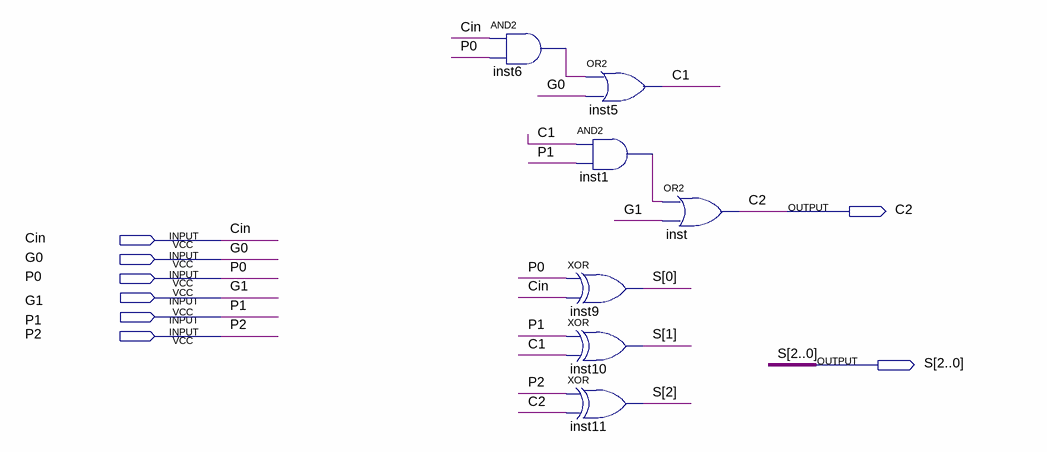
[diagram p0: schematic sheet]
// Quartus schematic COut3.bdf as structural Verilog: 7 symbols, 8 pins
module COut3 (
  input  Cin,
  input  G0,
  input  P0,
  input  G1,
  input  P1,
  input  P2,
  output C2,
  output [2:0] S
);

  wire C1, inst1_out, inst6_out;

  and inst6 (inst6_out, Cin, P0);
  or inst5 (C1, inst6_out, G0);
  and inst1 (inst1_out, C1, P1);
  xor inst9 (S[0], P0, Cin);
  xor inst10 (S[1], P1, C1);
  xor inst11 (S[2], P2, C2);
  or inst (C2, inst1_out, G1);
endmodule
